# Altium schematic sheet PSpice Switch.SchDoc: PSpice Switch
size A; DocumentNumber: 1; SheetNumber: 1; SheetTotal: 1
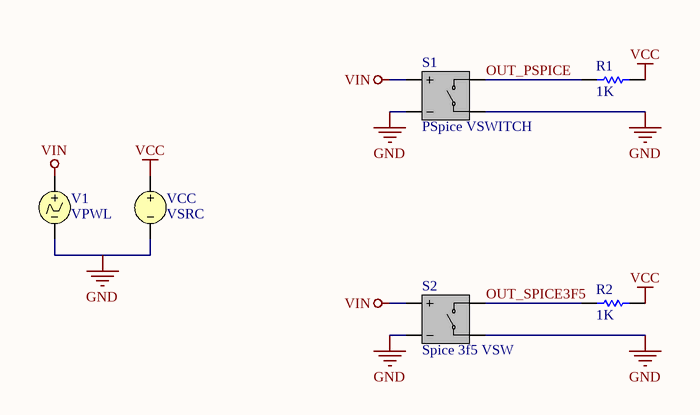
[diagram p0: PSpice Switch.SchDoc]

## Parts
R1  value 1K  [AXIAL-0.3]  (hidden comment: Res1)
R2  value 1K  [AXIAL-0.3]  (hidden comment: Res1)
S1  PSpice VSWITCH
S2  Spice 3f5 VSW
V1  VPWL
VCC  VSRC

## Nets
GND: S1.2(N1-) S1.4(N2-) S2.2(N1-) S2.4(N2-) V1.2 VCC.2
VCC: R1.1 R2.1 VCC.1
VIN: S1.1(N1+) S2.1(N1+) V1.1
OUT_PSPICE: R1.2 S1.3(N2+)
OUT_SPICE3F5: R2.2 S2.3(N2+)

## Notes on the sheet
- Title
- Size:
- Date:
- A
- Number:
- Time:
- Revision:
- Sheet
- of
- File:

## Library data of the parts
R1 R2 = Res1: Resistor; Published: 8-Jun-2000; LatestRevisionDate: 17-Jul-2002; LatestRevisionNote: Re-released for DXP Platform.; Publisher: Altium Limited
S1 S2 = VSW: Voltage Controlled Switch; Published: 8-Jun-2000; LatestRevisionDate: 17-Jul-2002; LatestRevisionNote: Re-released for DXP Platform.; PackageReference: Not Applicable; Publisher: Altium Limited
V1 = VPWL: Piecewise Linear Voltage Source; Note: PCB Footprint - Not required; Sim Note: To add model file containing time-current pairs of values, enter model location under "General Tab" in "Full Path" box.; Published: 8-Jun-2000; LatestRevisionDate: 17-Jul-2002; LatestRevisionNote: Re-released for DXP Platform.; PackageReference: Not Applicable; Publisher: Altium Limited
VCC = VSRC: Voltage Source; Note: PCB Footprint - Not required; Value: +12; Published: 8-Jun-2000; LatestRevisionDate: 17-Jul-2002; LatestRevisionNote: Re-released for DXP Platform.; PackageReference: Not Applicable; Publisher: Altium Limited